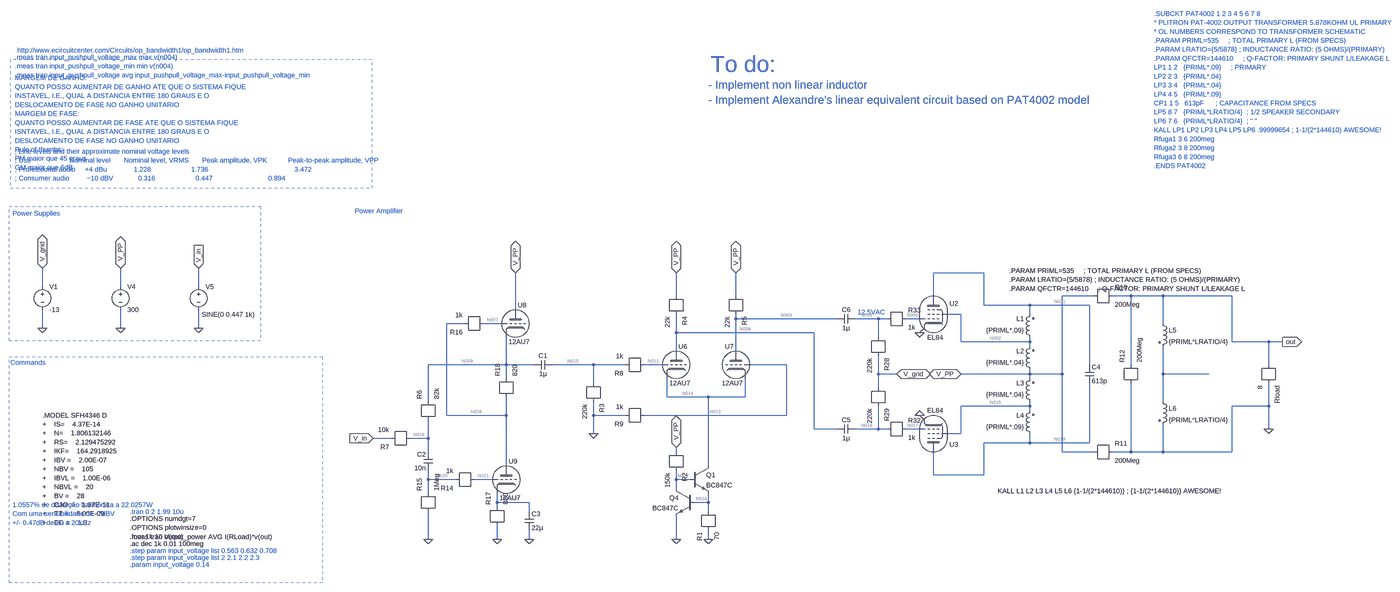
[diagram p0: schematic POWER_AMP_IC_rework_el84_transient_sine_transformer.asc, whole sheet]
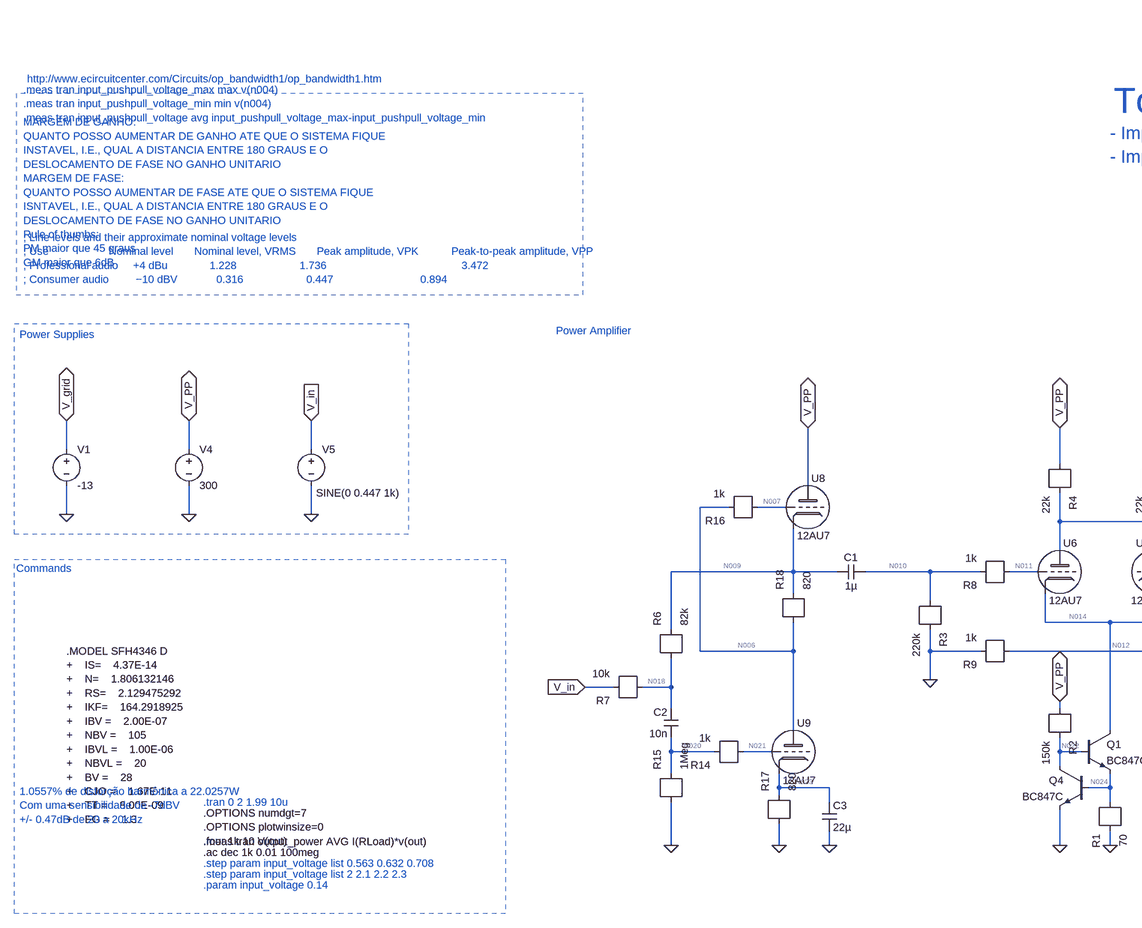
[diagram p1: schematic POWER_AMP_IC_rework_el84_transient_sine_transformer.asc, part, row 1 of 1, column 1 of 2]
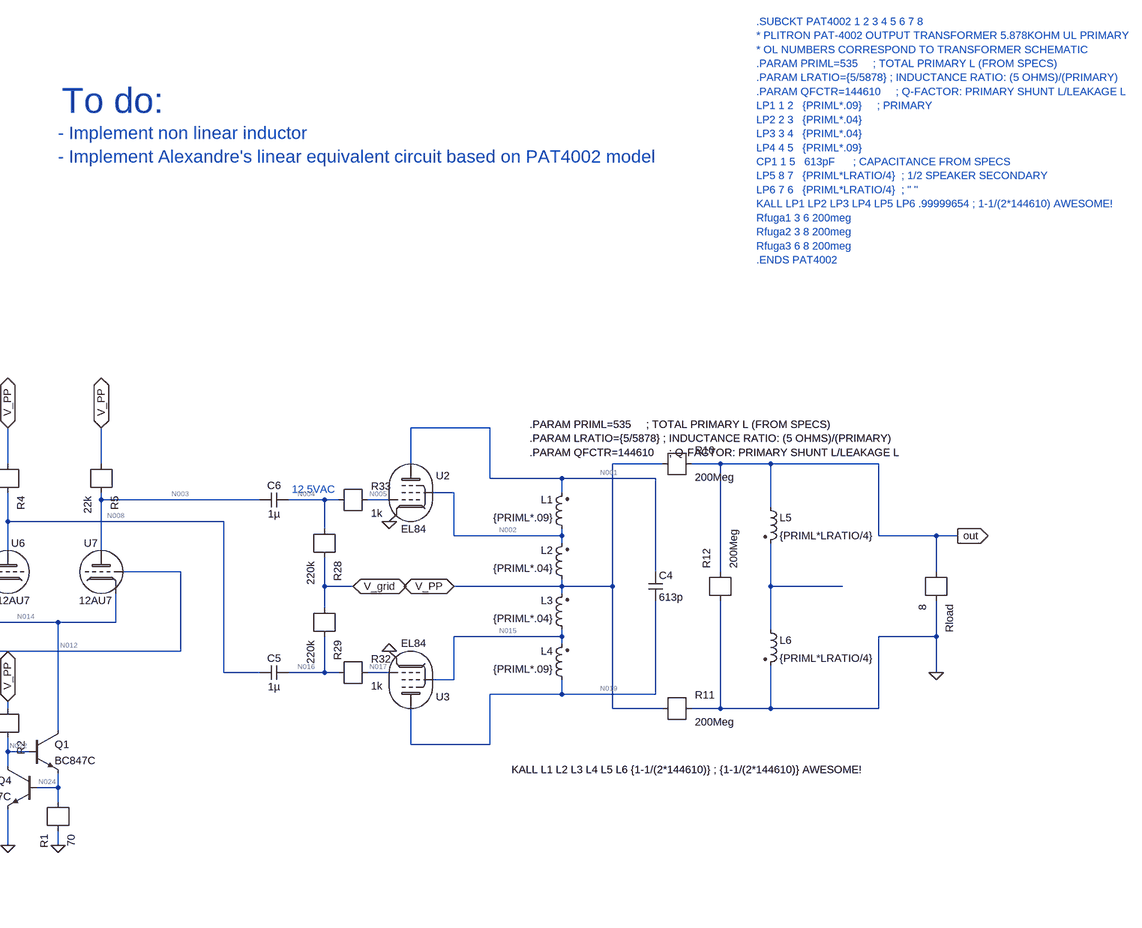
[diagram p2: schematic POWER_AMP_IC_rework_el84_transient_sine_transformer.asc, part, row 1 of 1, column 2 of 2]
POWER_AMP_IC_rework_el84_transient_sine_transformer.asc, the LTspice schematic file:
Version 4
SHEET 1 3124 1388
WIRE 912 -1200 736 -1200
WIRE -2368 -1152 -2368 -1216
WIRE -2096 -1152 -2096 -1216
WIRE -1824 -1152 -1824 -1216
WIRE -160 -1120 -160 -1200
WIRE 48 -1120 48 -1200
WIRE 736 -1120 736 -1200
WIRE 1296 -1120 1184 -1120
WIRE 1424 -1120 1360 -1120
WIRE 1536 -1120 1424 -1120
WIRE 1776 -1120 1536 -1120
WIRE 912 -1088 912 -1200
WIRE 1072 -1088 912 -1088
WIRE 1280 -1088 1072 -1088
WIRE -720 -1072 -720 -1200
WIRE 832 -1056 784 -1056
WIRE 1072 -1056 1072 -1088
WIRE 48 -1040 48 -1056
WIRE 400 -1040 48 -1040
WIRE 544 -1040 464 -1040
WIRE 576 -1040 544 -1040
WIRE 688 -1040 640 -1040
WIRE -896 -1024 -960 -1024
WIRE -768 -1024 -832 -1024
WIRE 1536 -1024 1536 -1120
WIRE -2368 -1008 -2368 -1072
WIRE -2096 -1008 -2096 -1072
WIRE -1824 -1008 -1824 -1072
WIRE -160 -992 -160 -1056
WIRE 320 -992 -160 -992
WIRE 544 -976 544 -1040
WIRE 832 -960 832 -1056
WIRE 1072 -960 1072 -976
WIRE 1072 -960 832 -960
WIRE 1776 -960 1776 -1120
WIRE 1904 -960 1776 -960
WIRE 1952 -960 1904 -960
WIRE 1072 -944 1072 -960
WIRE -160 -928 -160 -992
WIRE 48 -928 48 -1040
WIRE -752 -880 -752 -976
WIRE -752 -880 -1024 -880
WIRE -656 -880 -752 -880
WIRE -448 -880 -592 -880
WIRE -336 -880 -448 -880
WIRE -208 -880 -272 -880
WIRE 224 -880 96 -880
WIRE 1280 -880 1280 -1088
WIRE 1424 -880 1424 -1120
WIRE 1904 -880 1904 -960
WIRE 544 -848 544 -912
WIRE 608 -848 544 -848
WIRE 1072 -848 1072 -864
WIRE 1072 -848 832 -848
WIRE 1184 -848 1184 -1120
WIRE 1184 -848 1072 -848
WIRE 1536 -848 1536 -944
WIRE 1696 -848 1536 -848
WIRE -752 -832 -752 -880
WIRE 1072 -832 1072 -848
WIRE -448 -816 -448 -880
WIRE 544 -800 544 -848
WIRE -192 -768 -192 -832
WIRE -48 -768 -192 -768
WIRE 80 -768 80 -832
WIRE 80 -768 -48 -768
WIRE -1024 -752 -1024 -880
WIRE 1536 -752 1536 -848
WIRE 1072 -736 1072 -752
WIRE 1072 -736 832 -736
WIRE 1904 -736 1904 -816
WIRE 1904 -736 1776 -736
WIRE 1072 -720 1072 -736
WIRE -960 -704 -960 -1024
WIRE -752 -704 -752 -768
WIRE -752 -704 -960 -704
WIRE -448 -704 -448 -752
WIRE -336 -704 -448 -704
WIRE 224 -704 224 -880
WIRE 224 -704 -272 -704
WIRE 320 -656 320 -992
WIRE 400 -656 320 -656
WIRE 544 -656 544 -736
WIRE 544 -656 464 -656
WIRE 576 -656 544 -656
WIRE 688 -656 640 -656
WIRE 1904 -656 1904 -736
WIRE -448 -640 -448 -704
WIRE 832 -640 832 -736
WIRE 832 -640 784 -640
WIRE -1152 -624 -1216 -624
WIRE -1024 -624 -1024 -688
WIRE -1024 -624 -1088 -624
WIRE 1072 -608 1072 -640
WIRE 1072 -608 912 -608
WIRE 1280 -608 1280 -816
WIRE 1280 -608 1072 -608
WIRE -1024 -576 -1024 -624
WIRE -160 -576 -160 -592
WIRE 1184 -576 1184 -848
WIRE 1296 -576 1184 -576
WIRE 1424 -576 1424 -816
WIRE 1424 -576 1360 -576
WIRE 1536 -576 1536 -672
WIRE 1536 -576 1424 -576
WIRE 1776 -576 1776 -736
WIRE 1776 -576 1536 -576
WIRE -752 -528 -752 -704
WIRE -48 -528 -48 -768
WIRE 736 -496 736 -576
WIRE 912 -496 912 -608
WIRE 912 -496 736 -496
WIRE -1024 -480 -1024 -512
WIRE -928 -480 -1024 -480
WIRE -800 -480 -864 -480
WIRE -160 -480 -160 -512
WIRE -112 -480 -160 -480
WIRE -160 -448 -160 -480
WIRE -1024 -432 -1024 -480
WIRE -784 -400 -784 -432
WIRE -672 -400 -784 -400
WIRE -48 -400 -48 -432
WIRE -48 -400 -96 -400
WIRE -784 -384 -784 -400
WIRE -672 -368 -672 -400
WIRE -48 -368 -48 -400
WIRE -1024 -272 -1024 -368
WIRE -784 -272 -784 -320
WIRE -672 -272 -672 -304
WIRE -160 -272 -160 -352
WIRE -48 -272 -48 -304
FLAG -1824 -1008 0
FLAG -2096 -1008 0
FLAG -2368 -1008 0
FLAG -2368 -1216 V_grid
IOPIN -2368 -1216 BiDir
FLAG 688 -992 0
FLAG 688 -704 0
FLAG 608 -848 V_grid
IOPIN 608 -848 BiDir
FLAG 1904 -656 0
FLAG 1952 -960 out
IOPIN 1952 -960 Out
FLAG -2096 -1216 V_PP
IOPIN -2096 -1216 BiDir
FLAG 832 -848 V_PP
IOPIN 832 -848 BiDir
FLAG -448 -640 0
FLAG -1216 -624 V_in
IOPIN -1216 -624 In
FLAG -1024 -272 0
FLAG -784 -272 0
FLAG -48 -272 0
FLAG -160 -272 0
FLAG -160 -592 V_PP
IOPIN -160 -592 BiDir
FLAG 48 -1200 V_PP
IOPIN 48 -1200 BiDir
FLAG -160 -1200 V_PP
IOPIN -160 -1200 BiDir
FLAG -720 -1200 V_PP
IOPIN -720 -1200 BiDir
FLAG -672 -272 0
FLAG -1824 -1216 V_in
IOPIN -1824 -1216 In
SYMBOL voltage -2096 -1168 R0
SYMATTR InstName V4
SYMATTR Value 300
SYMBOL voltage -1824 -1168 R0
WINDOW 3 11 113 Left 2
SYMATTR Value SINE(0 0.447 1k)
SYMATTR InstName V5
SYMATTR Value2 AC 1
SYMBOL voltage -2368 -1168 R0
SYMATTR InstName V1
SYMATTR Value -13
SYMBOL r 544 -976 R90
SYMATTR InstName R28
SYMATTR Value 220k
SYMBOL r 544 -800 R90
SYMATTR InstName R29
SYMATTR Value 220k
SYMBOL r 576 -656 R0
SYMATTR InstName R32
SYMATTR Value 1k
SYMBOL r 576 -1040 R0
SYMATTR InstName R33
SYMATTR Value 1k
SYMBOL cap 464 -672 R90
WINDOW 0 0 32 VBottom 2
WINDOW 3 32 32 VTop 2
SYMATTR InstName C5
SYMATTR Value 1µ
SYMBOL cap 464 -1056 R90
WINDOW 0 0 32 VBottom 2
WINDOW 3 32 32 VTop 2
SYMATTR InstName C6
SYMATTR Value 1µ
SYMBOL r 1904 -880 R90
SYMATTR InstName Rload
SYMATTR Value 8
SYMBOL EL84 736 -1056 R0
SYMATTR InstName U2
SYMBOL EL84 736 -640 M180
SYMATTR InstName U3
SYMBOL npn -112 -528 R0
SYMATTR InstName Q1
SYMATTR Value BC847C
SYMBOL npn -96 -448 M0
SYMATTR InstName Q4
SYMATTR Value BC847C
SYMBOL r -48 -368 M90
SYMATTR InstName R1
SYMATTR Value 70
SYMBOL r -160 -576 R90
SYMATTR InstName R2
SYMATTR Value 150k
SYMBOL r -448 -816 R90
SYMATTR InstName R3
SYMATTR Value 220k
SYMBOL r -160 -1120 R90
SYMATTR InstName R4
SYMATTR Value 22k
SYMBOL r 48 -1120 R90
SYMATTR InstName R5
SYMATTR Value 22k
SYMBOL 12AU7 -160 -880 R0
SYMATTR InstName U6
SYMBOL 12AU7 48 -880 M0
SYMATTR InstName U7
SYMBOL cap -592 -896 R90
WINDOW 0 0 32 VBottom 2
WINDOW 3 32 32 VTop 2
SYMATTR InstName C1
SYMATTR Value 1µ
SYMBOL r -272 -880 R180
SYMATTR InstName R8
SYMATTR Value 1k
SYMBOL r -272 -704 R180
SYMATTR InstName R9
SYMATTR Value 1k
SYMBOL r -864 -480 R180
SYMATTR InstName R14
SYMATTR Value 1k
SYMBOL r -1024 -368 R270
SYMATTR InstName R15
SYMATTR Value 1Meg
SYMBOL r -832 -1024 R180
SYMATTR InstName R16
SYMATTR Value 1k
SYMBOL r -784 -320 R270
SYMATTR InstName R17
SYMATTR Value 820
SYMBOL r -752 -768 R270
SYMATTR InstName R18
SYMATTR Value 820
SYMBOL 12AU7 -720 -1024 R0
SYMATTR InstName U8
SYMBOL 12AU7 -752 -480 R0
SYMATTR InstName U9
SYMBOL r -1024 -688 R270
SYMATTR InstName R6
SYMATTR Value 82k
SYMBOL cap -1008 -576 M0
SYMATTR InstName C2
SYMATTR Value 10n
SYMBOL r -1088 -624 R180
SYMATTR InstName R7
SYMATTR Value 10k
SYMBOL cap -688 -368 R0
SYMATTR InstName C3
SYMATTR Value 22µ
SYMBOL ind2 1088 -960 R180
WINDOW 0 36 80 Left 2
WINDOW 3 36 40 Left 2
SYMATTR InstName L1
SYMATTR Value {PRIML*.09}
SYMATTR Type ind
SYMBOL ind2 1088 -848 R180
WINDOW 0 36 80 Left 2
WINDOW 3 36 40 Left 2
SYMATTR InstName L2
SYMATTR Value {PRIML*.04}
SYMATTR Type ind
SYMBOL ind2 1088 -736 R180
WINDOW 0 36 80 Left 2
WINDOW 3 36 40 Left 2
SYMATTR InstName L3
SYMATTR Value {PRIML*.04}
SYMATTR Type ind
SYMBOL ind2 1088 -624 R180
WINDOW 0 36 80 Left 2
WINDOW 3 36 40 Left 2
SYMATTR InstName L4
SYMATTR Value {PRIML*.09}
SYMATTR Type ind
SYMBOL cap 1264 -880 R0
SYMATTR InstName C4
SYMATTR Value 613p
SYMBOL r 1296 -1120 R0
SYMATTR InstName R10
SYMATTR Value 200Meg
SYMBOL r 1296 -576 R0
SYMATTR InstName R11
SYMATTR Value 200Meg
SYMBOL r 1424 -816 R270
SYMATTR InstName R12
SYMATTR Value 200Meg
SYMBOL ind2 1520 -1040 R0
SYMATTR InstName L5
SYMATTR Value {PRIML*LRATIO/4}
SYMATTR Type ind
SYMBOL ind2 1520 -768 R0
SYMATTR InstName L6
SYMATTR Value {PRIML*LRATIO/4}
SYMATTR Type ind
TEXT -2064 -344 Left 2 !.OPTIONS numdgt=7\n.OPTIONS plotwinsize=0\n.four 1k 10 V(out)
TEXT -2368 -704 Left 2 !.MODEL SFH4346 D	\n+	IS=	4.37E-14\n+	N=	1.806132146\n+	RS=	2.129475292\n+	IKF=	164.2918925\n+	IBV =	2.00E-07\n+	NBV =	105\n+	IBVL =	1.00E-06\n+	NBVL =	20\n+	BV =	28\n+	CJO =	1.67E-11\n+	TT =	8.00E-09\n+	EG =	1.3
TEXT -2480 -888 Left 2 ;Commands
TEXT -2472 -1408 Left 2 ;Power Supplies
TEXT -2464 -1880 Left 2 ;MARGEM DE GANHO:\nQUANTO POSSO AUMENTAR DE GANHO ATE QUE O SISTEMA FIQUE\nINSTAVEL, I.E., QUAL A DISTANCIA ENTRE 180 GRAUS E O \nDESLOCAMENTO DE FASE NO GANHO UNITARIO\nMARGEM DE FASE:\nQUANTO POSSO AUMENTAR DE FASE ATE QUE O SISTEMA FIQUE \nISNTAVEL, I.E., QUAL A DISTANCIA ENTRE 180 GRAUS E O \nDESLOCAMENTO DE FASE NO GANHO UNITARIO\nRule of thumbs:\nPM maior que 45 graus\nGM maior que 6dB
TEXT -1280 -1416 Left 2 ;Power Amplifier
TEXT -2064 -280 Left 2 !.meas tran output_power AVG I(RLoad)*v(out)
TEXT -2064 -232 Left 2 ;.step param input_voltage list 0.563 0.632 0.708
TEXT -2472 -392 Left 2 ;1.0557% de distorção harmônica a 22.0257W\nCom uma sensibilidade de -7dBV\n+/- 0.47dB de 20 a 20kHz
TEXT -2064 -208 Left 2 ;.step param input_voltage list 2 2.1 2.2 2.3
TEXT -2064 -184 Left 2 ;.param input_voltage 0.14
TEXT -2464 -1624 Left 2 ;; Line levels and their approximate nominal voltage levels\n; Use                	Nominal level   	Nominal level, VRMS   	Peak amplitude, VPK   		Peak-to-peak amplitude, VPP\n; Professional audio 	+4 dBu          	1.228                 	1.736                 							3.472\n; Consumer audio     	−10 dBV         	0.316                 	0.447                 			0.894
TEXT -2464 -1952 Left 2 ;.meas tran input_pushpull_voltage_max max v(n004)\n.meas tran input_pushpull_voltage_min min v(n004)\n.meas tran input_pushpull_voltage avg input_pushpull_voltage_max-input_pushpull_voltage_min
TEXT 472 -1064 Left 2 ;12.5VAC
TEXT -2456 -1976 Left 2 ;http://www.ecircuitcenter.com/Circuits/op_bandwidth1/op_bandwidth1.htm
TEXT -2064 -368 Left 2 ;.tran 0 2 1.99 10u
TEXT -40 -1928 Left 6 ;To do:
TEXT 1504 -2104 Left 2 ;.SUBCKT PAT4002 1 2 3 4 5 6 7 8\n* PLITRON PAT-4002 OUTPUT TRANSFORMER 5.878KOHM UL PRIMARY\n* OL NUMBERS CORRESPOND TO TRANSFORMER SCHEMATIC\n.PARAM PRIML=535     ; TOTAL PRIMARY L (FROM SPECS)\n.PARAM LRATIO={5/5878} ; INDUCTANCE RATIO: (5 OHMS)/(PRIMARY)\n.PARAM QFCTR=144610     ; Q-FACTOR: PRIMARY SHUNT L/LEAKAGE L\nLP1 1 2   {PRIML*.09}     ; PRIMARY\nLP2 2 3   {PRIML*.04}\nLP3 3 4   {PRIML*.04}\nLP4 4 5   {PRIML*.09}\nCP1 1 5   613pF      ; CAPACITANCE FROM SPECS\nLP5 8 7   {PRIML*LRATIO/4}  ; 1/2 SPEAKER SECONDARY\nLP6 7 6   {PRIML*LRATIO/4}  ; " "\nKALL LP1 LP2 LP3 LP4 LP5 LP6 .99999654 ; 1-1/(2*144610) AWESOME!\nRfuga1 3 6 200meg\nRfuga2 3 8 200meg\nRfuga3 6 8 200meg\n.ENDS PAT4002
TEXT 1000 -1208 Left 2 !.PARAM PRIML=535     ; TOTAL PRIMARY L (FROM SPECS)\n.PARAM LRATIO={5/5878} ; INDUCTANCE RATIO: (5 OHMS)/(PRIMARY)\n.PARAM QFCTR=144610     ; Q-FACTOR: PRIMARY SHUNT L/LEAKAGE L
TEXT 960 -440 Left 2 !KALL L1 L2 L3 L4 L5 L6 {1-1/(2*144610)} ; {1-1/(2*144610)} AWESOME!
TEXT -2064 -256 Left 2 !.ac dec 1k 0.01 100meg
TEXT -48 -1856 Left 4 ;- Implement non linear inductor\n- Implement Alexandre's linear equivalent circuit based on PAT4002 model
RECTANGLE Normal -2484 -908 -1392 -120 2
RECTANGLE Normal -2484 -1432 -1608 -964 2
RECTANGLE Normal -2480 -1496 -1220 -1944 2

The netlist it stands for:
* POWER_AMP_IC_rework_el84_transient_sine_transformer.asc
V4 V_PP 0 300
V5 V_in 0 SINE(0 0.447 1k) AC 1
V1 V_grid 0 -13
R28 V_grid N004 220k
R29 N016 V_grid 220k
R32 N017 N016 1k
R33 N005 N004 1k
C5 N016 N008 1µ
C6 N004 N003 1µ
Rload 0 out 8
XU2 N001 N002 N005 0 EL84  ; pins Placa Grade_Screen Grade_controle Câtodo
XU3 N019 N015 N017 0 EL84  ; pins Placa Grade_Screen Grade_controle Câtodo
Q1 N014 N022 N024 0 BC847C
Q4 N022 N024 0 0 BC847C
R1 0 N024 70
R2 N022 V_PP 150k
R3 0 N010 220k
R4 N008 V_PP 22k
R5 N003 V_PP 22k
XU6 N008 N011 N014 12AU7  ; pins Plate Grid Cathode
XU7 N003 N012 N014 12AU7  ; pins Plate Grid Cathode
C1 N010 N009 1µ
R8 N010 N011 1k
R9 0 N012 1k
R14 N020 N021 1k
R15 N020 0 1Meg
R16 N006 N007 1k
R17 N023 0 820
R18 N009 N006 820
XU8 V_PP N007 N009 12AU7  ; pins Plate Grid Cathode
XU9 N006 N021 N023 12AU7  ; pins Plate Grid Cathode
R6 N009 N018 82k
C2 N018 N020 10n
R7 V_in N018 10k
C3 N023 0 22µ
L1 N002 N001 {PRIML*.09}
L2 V_PP N002 {PRIML*.04}
L3 N015 V_PP {PRIML*.04}
L4 N019 N015 {PRIML*.09}
C4 N001 N019 613p
R10 out V_PP 200Meg
R11 0 V_PP 200Meg
R12 out 0 200Meg
L5 out N013 {PRIML*LRATIO/4}
L6 N013 0 {PRIML*LRATIO/4}
.model NPN NPN
.model PNP PNP
.lib standard.bjt
.OPTIONS numdgt=7
.OPTIONS plotwinsize=0
.four 1k 10 V(out)
.MODEL SFH4346 D
+	IS=	4.37E-14
+	N=	1.806132146
+	RS=	2.129475292
+	IKF=	164.2918925
+	IBV =	2.00E-07
+	NBV =	105
+	IBVL =	1.00E-06
+	NBVL =	20
+	BV =	28
+	CJO =	1.67E-11
+	TT =	8.00E-09
+	EG =	1.3
* Commands
* Power Supplies
* MARGEM DE GANHO:
* QUANTO POSSO AUMENTAR DE GANHO ATE QUE O SISTEMA FIQUE
* INSTAVEL, I.E., QUAL A DISTANCIA ENTRE 180 GRAUS E O
* DESLOCAMENTO DE FASE NO GANHO UNITARIO
* MARGEM DE FASE:
* QUANTO POSSO AUMENTAR DE FASE ATE QUE O SISTEMA FIQUE
* ISNTAVEL, I.E., QUAL A DISTANCIA ENTRE 180 GRAUS E O
* DESLOCAMENTO DE FASE NO GANHO UNITARIO
* Rule of thumbs:
* PM maior que 45 graus
* GM maior que 6dB
* Power Amplifier
.meas tran output_power AVG I(RLoad)*v(out)
* .step param input_voltage list 0.563 0.632 0.708
* 1.0557% de distorção harmônica a 22.0257W
* Com uma sensibilidade de -7dBV
* +/- 0.47dB de 20 a 20kHz
* .step param input_voltage list 2 2.1 2.2 2.3
* .param input_voltage 0.14
* ; Line levels and their approximate nominal voltage levels
* ; Use                	Nominal level   	Nominal level, VRMS   	Peak amplitude, VPK   		Peak-to-peak amplitude, VPP
* ; Professional audio 	+4 dBu          	1.228                 	1.736                 							3.472
* ; Consumer audio     	−10 dBV         	0.316                 	0.447                 			0.894
* .meas tran input_pushpull_voltage_max max v(n004)
* .meas tran input_pushpull_voltage_min min v(n004)
* .meas tran input_pushpull_voltage avg input_pushpull_voltage_max-input_pushpull_voltage_min
* 12.5VAC
* http://www.ecircuitcenter.com/Circuits/op_bandwidth1/op_bandwidth1.htm
* .tran 0 2 1.99 10u
* To do:
* .SUBCKT PAT4002 1 2 3 4 5 6 7 8
* * PLITRON PAT-4002 OUTPUT TRANSFORMER 5.878KOHM UL PRIMARY
* * OL NUMBERS CORRESPOND TO TRANSFORMER SCHEMATIC
* .PARAM PRIML=535     ; TOTAL PRIMARY L (FROM SPECS)
* .PARAM LRATIO={5/5878} ; INDUCTANCE RATIO: (5 OHMS)/(PRIMARY)
* .PARAM QFCTR=144610     ; Q-FACTOR: PRIMARY SHUNT L/LEAKAGE L
* LP1 1 2   {PRIML*.09}     ; PRIMARY
* LP2 2 3   {PRIML*.04}
* LP3 3 4   {PRIML*.04}
* LP4 4 5   {PRIML*.09}
* CP1 1 5   613pF      ; CAPACITANCE FROM SPECS
* LP5 8 7   {PRIML*LRATIO/4}  ; 1/2 SPEAKER SECONDARY
* LP6 7 6   {PRIML*LRATIO/4}  ; " "
* KALL LP1 LP2 LP3 LP4 LP5 LP6 .99999654 ; 1-1/(2*144610) AWESOME!
* Rfuga1 3 6 200meg
* Rfuga2 3 8 200meg
* Rfuga3 6 8 200meg
* .ENDS PAT4002
.PARAM PRIML=535     ; TOTAL PRIMARY L (FROM SPECS)
.PARAM LRATIO={5/5878} ; INDUCTANCE RATIO: (5 OHMS)/(PRIMARY)
.PARAM QFCTR=144610     ; Q-FACTOR: PRIMARY SHUNT L/LEAKAGE L
KALL L1 L2 L3 L4 L5 L6 {1-1/(2*144610)} ; {1-1/(2*144610)} AWESOME!
.ac dec 1k 0.01 100meg
* - Implement non linear inductor
* - Implement Alexandre's linear equivalent circuit based on PAT4002 model
.lib tubes.lib
.lib tube.lib
.backanno
.end

* Results of the author's LTspice run, read from the files saved beside the schematic
* Operating Point, zero values left out:
*   V(v_pp) = 300 V
*   V(v_grid) = -13 V
*   V(n004) = -13 V
*   V(n016) = -13 V
*   V(n017) = -13 V
*   V(n005) = -13 V
*   V(n008) = 197 V
*   V(n003) = 197 V
*   V(n001) = 300 V
*   V(n002) = 300 V
*   V(n019) = 300 V
*   V(n015) = 300 V
*   V(n014) = 7.729 V
*   V(n022) = 1.359 V
*   V(n024) = 656.5 mV
*   V(n010) = 221.7 µV
*   V(n011) = 222.7 µV
*   V(n012) = 1.008 µV
*   V(n009) = 148.1 V
*   V(n020) = 1.004 mV
*   V(n021) = 1.005 mV
*   V(n006) = 143.6 V
*   V(n007) = 143.6 V
*   V(n023) = 4.476 V
*   V(n018) = 16.1 V
*   Ic(Q4) = 1.967 mA
*   Ib(Q4) = 5.414 µA
*   Ie(Q4) = -1.973 mA
*   Ic(Q1) = 9.36 mA
*   Ib(Q1) = 23.84 µA
*   Ie(Q1) = -9.384 mA
*   I(L6) = 1.5 µA
*   I(L5) = 1.5 µA
*   I(L4) = -23.12 mA
*   I(L3) = -23.37 mA
*   I(L2) = 23.37 mA
*   I(L1) = 23.12 mA
*   I(R11) = -1.5 µA
*   I(R10) = -1.5 µA
*   I(R7) = -1.61 mA
*   I(R6) = 1.61 mA
*   I(R18) = 5.458 mA
*   I(R17) = 5.458 mA
*   I(R16) = -1.004 nA
*   I(R15) = 1.004 nA
*   I(R14) = -1.004 nA
*   I(R9) = -1.008 nA
*   I(R8) = -1.008 nA
*   I(R5) = -4.68 mA
*   I(R4) = -4.68 mA
*   I(R3) = -1.008 nA
*   I(R2) = -1.991 mA
*   I(R1) = -9.378 mA
*   I(R33) = 1.013 nA
*   I(R32) = 1.013 nA
*   I(R29) = 1.013 nA
*   I(R28) = -1.013 nA
*   I(V1) = 2.026 nA
*   I(V5) = 1.61 mA
*   I(V4) = -65.17 mA